# EAGLE design ADXL Breakout Board V1 (EAGLE 9.6.1)
COMPANY: ADAFRUIT INDUSTRIES; DRAWN: KTOWN; REV: A; YEAR: 2018
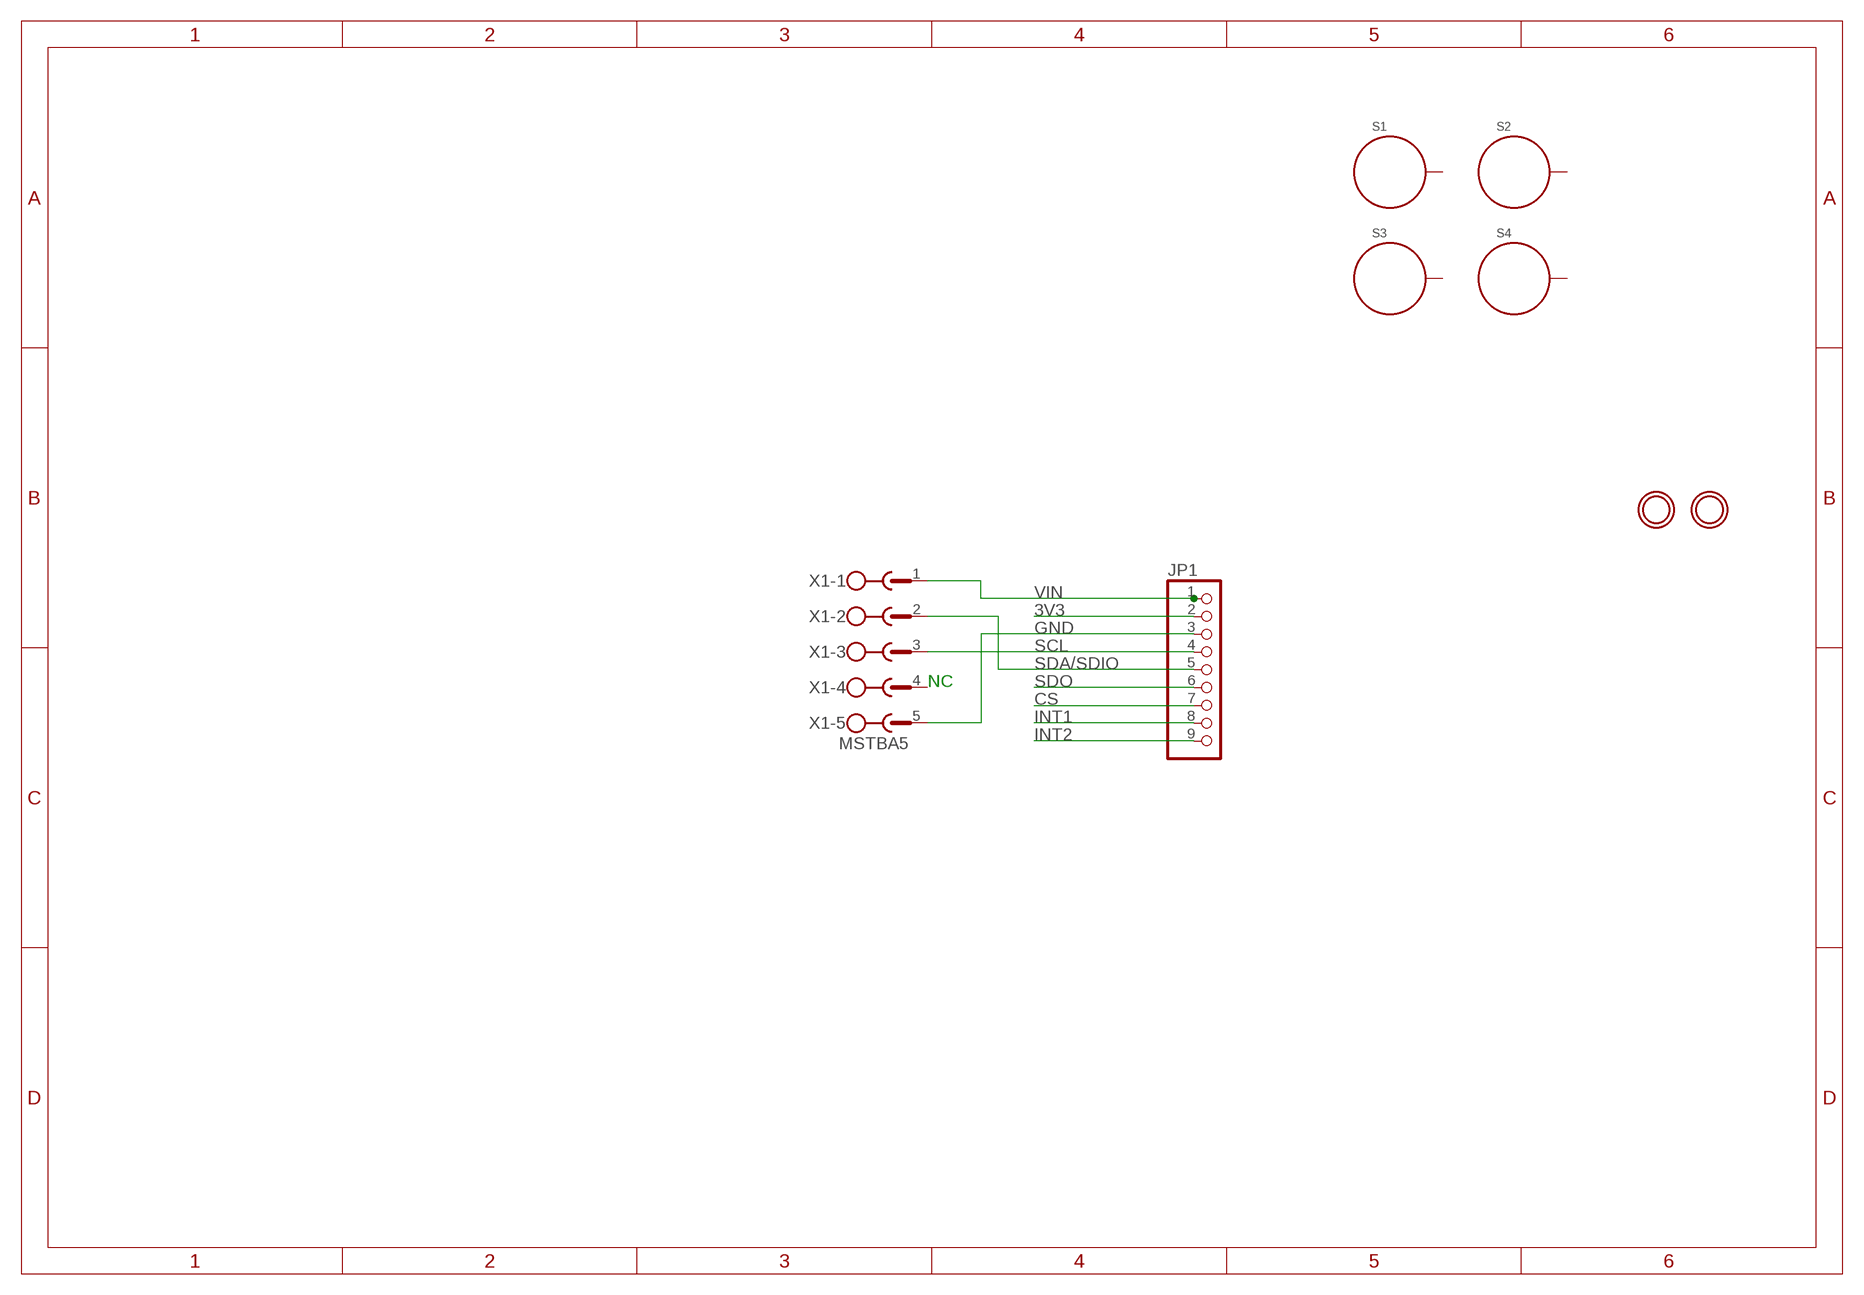
[diagram p0: schematic, sheet 1]

## Parts
JP1  HEADER-1X970MIL  [1X09_ROUND_70]
S1  STANDOFF_ELECTRICAL5-32  [STANDOFF_ELECTRICAL_5_32]
S2  STANDOFF_ELECTRICAL5-32  [STANDOFF_ELECTRICAL_5_32]
S3  STANDOFF_ELECTRICAL5-32  [STANDOFF_ELECTRICAL_5_32]
S4  STANDOFF_ELECTRICAL5-32  [STANDOFF_ELECTRICAL_5_32]
U$4  MOUNTINGHOLE2.5  [MOUNTINGHOLE_2.5_PLATED]
U$6  MOUNTINGHOLE2.5  [MOUNTINGHOLE_2.5_PLATED]
X1  MSTBA5  [MSTBA5]

## Nets
3V3: JP1.2
CS: JP1.7
GND: JP1.3 X1.5
INT1: JP1.8
INT2: JP1.9
SCL: JP1.4 X1.3
SDA/SDIO: JP1.5 X1.2
SDO: JP1.6
VIN: JP1.1 X1.1
Unconnected: S1.P1 S2.P1 S3.P1 S4.P1 X1.4

## Notes on the sheet
- NC

## Library data of the parts
JP1 = microbuilder:HEADER-1X9: PIN HEADER
S1-S4 = th_libraries:STANDOFF_ELECTRICAL: A standoff intended to be an electrically connected point. Pad size and stop size allow for a #8 Phillips pan screw head to make a solid connection to the board. Added 144mill drill hole that fits my normal wood screw
U$4 U$6 = microbuilder:MOUNTINGHOLE: Mounting Hole For #2 screws (0.086"/2.18mm width, 0.094"/2.4mm hole) use 2.5mm; BOM: EXCLUDE
X1 = con-phoenix-508:MSTBA5: PHOENIX; MPN: 1757271; OC_FARNELL: 3705201; OC_NEWARK: 71C4164

## Board
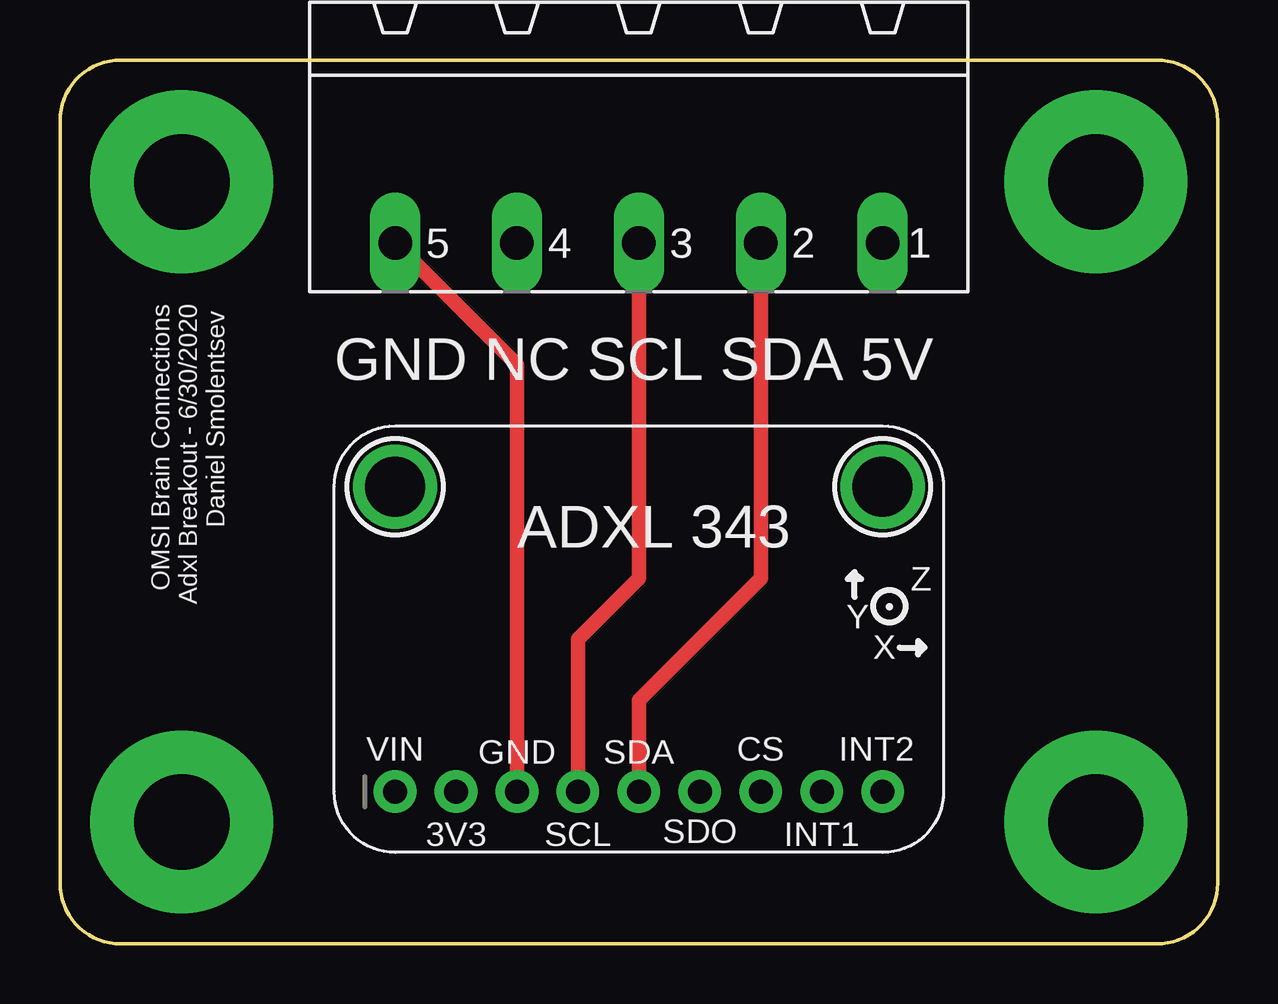
[diagram p1: board, top side]
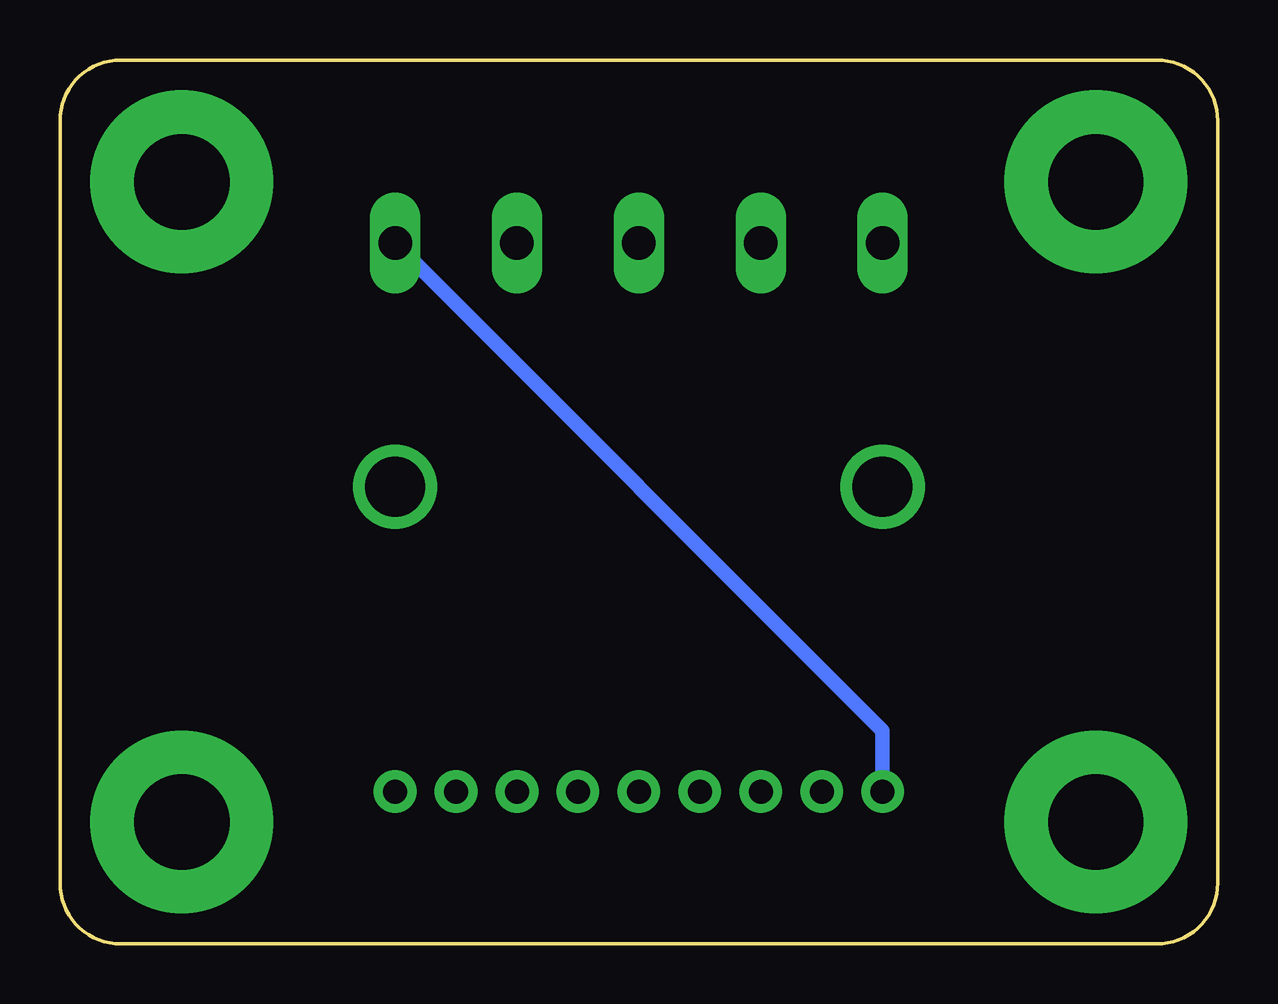
[diagram p2: board, bottom side, seen from below]

Size 48.26 x 36.83 mm. Coordinates in mm from the lower left corner, seen from the top.
Outline: 2.54,36.83 45.72,36.83 arc-90 48.26,34.29 48.26,2.54 arc-90 45.72,0 2.54,0 arc-90 0,2.54 0,34.29 arc-90 2.54,36.83
Copper layers (1*16): Top 0.035mm / dielectric 1.5mm / Bottom 0.035mm
Design rules "adafruit": minimum track width 8mil, minimum drill 15.5mil, track to track 8mil, track to pad 8mil, pad to pad 8mil, via to via 8mil, smd to smd 8mil, copper to edge 10mil, drill to drill 8mil, minimum pad ring 10mil, minimum via ring 8mil, stop-mask expansion 2mil, vias tented up to drill 20mil, thermal gap 10mil

### Footprints (pad centres in the part's own frame; a part is rotated, then mirrored left to right if it is on the bottom)
1X09_ROUND_70 = drill 1 pad 1.778: 1 -10.16,0; 2 -7.62,0; 3 -5.08,0; 4 -2.54,0; 5 0,0; 6 2.54,0; 7 5.08,0; 8 7.62,0; 9 10.16,0
STANDOFF_ELECTRICAL_5_32 = drill 3.969 pad 7.62: P1 0,0
MOUNTINGHOLE_2.5_PLATED = drill 2.5 pad 3.2: P$1 0,0
MSTBA5 = drill 1.397 long: 1 -10.16,5.08; 2 -5.08,5.08; 3 0,5.08; 4 5.08,5.08; 5 10.16,5.08

### Placement (x,y rotation side)
JP1  24.13,6.35 0 top
S1  5.08,31.75 0 top
S2  43.18,31.75 0 top
S3  43.18,5.08 0 top
S4  5.08,5.08 0 top
U$4  34.29,19.05 0 top
U$6  13.97,19.05 0 top
X1  24.13,34.29 180 top

### Tracks (layer width: path | path; a pad name or v marks a point on that pad's centre or on a via)
GND
  Top 0.61: X1.5 19.05,24.13 JP1.3
SCL
  Top 0.61: X1.3 24.13,15.24 21.59,12.7 JP1.4
SDA/SDIO
  Top 0.61: X1.2 29.21,15.24 24.13,10.16 JP1.5
VIN
  Bottom 0.61: X1.1 13.97,8.89 JP1.1

### Text on the board
tPlace: OMSI Brain Connections / Adxl Breakout - 6/30/2020 / Daniel Smolentsev | Z | Y | X | VIN | GND | SDA | CS | INT2 | 3V3 | SCL | SDO | INT1
tNames: GND NC SCL SDA 5V | ADXL 343